# Altium schematic sheet 10 - ETHERNET.SchDoc
size 420 x 297 mm
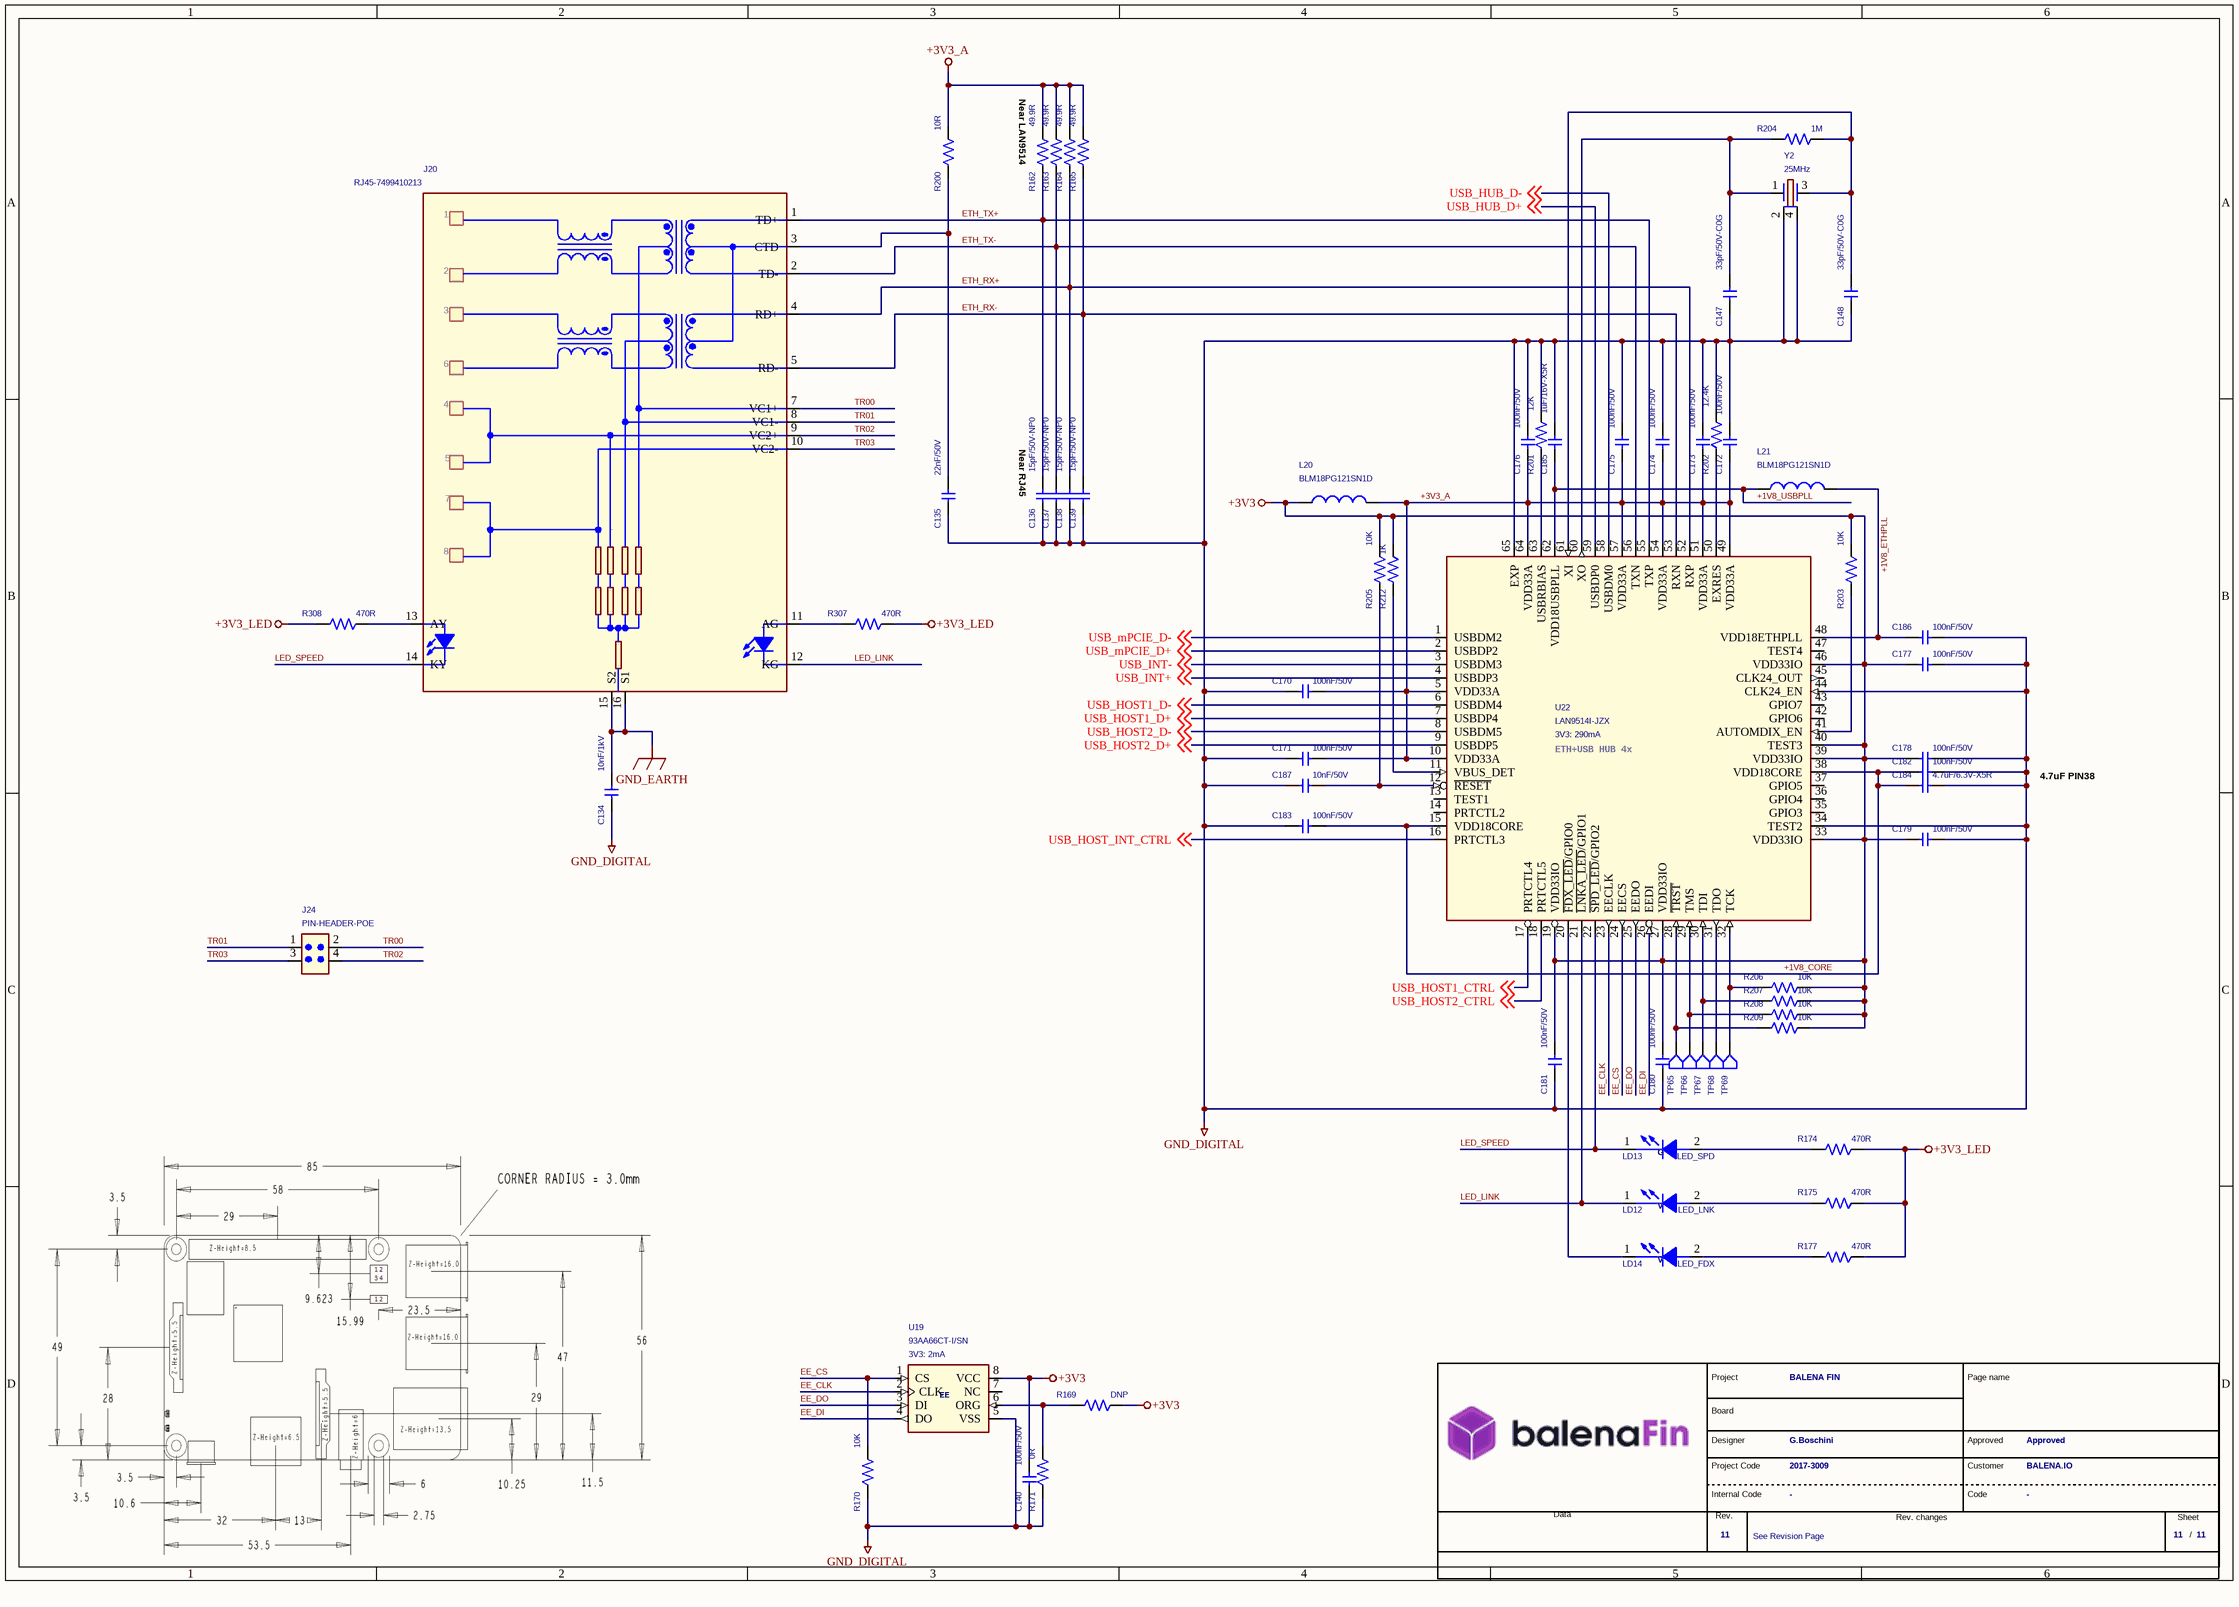
[diagram p0: 10 - ETHERNET.SchDoc]

## Parts
*  Revision: 11  FAE RD code: 2017-3009  DocumentoRev: See Revision Page  Nome Progetto: BALENA FIN  Customer name: BALENA.IO  Project manager: Approved  Project designer: G.Boschini  (hidden comment: MyFAEVuoto)  (graphical)
C134  10nF/1kV  [CS-C-1206]
C135  22nF/50V  [CS-C-0603]
C136  15pF/50V-NP0  [CS-C-0402]
C137  15pF/50V-NP0  [CS-C-0402]
C138  15pF/50V-NP0  [CS-C-0402]
C139  15pF/50V-NP0  [CS-C-0402]
C140  100nF/50V  [CS-C-0402]
C147  33pF/50V-C0G  [CS-C-0402]
C148  33pF/50V-C0G  [CS-C-0402]
C170  100nF/50V  [CS-C-0402]
C171  100nF/50V  [CS-C-0402]
C172  100nF/50V  [CS-C-0402]
C173  100nF/50V  [CS-C-0402]
C174  100nF/50V  [CS-C-0402]
C175  100nF/50V  [CS-C-0402]
C176  100nF/50V  [CS-C-0402]
C177  100nF/50V  [CS-C-0402]
C178  100nF/50V  [CS-C-0402]
C179  100nF/50V  [CS-C-0402]
C180  100nF/50V  [CS-C-0402]
C181  100nF/50V  [CS-C-0402]
C182  100nF/50V  [CS-C-0402]
C183  100nF/50V  [CS-C-0402]
C184  4.7uF/6.3V-X5R  [CS-C-0402]
C185  1uF/16V-X5R  [CS-C-0402]
C186  100nF/50V  [CS-C-0402]
C187  10nF/50V  [CS-C-0402]
J20  RJ45-7499410213  [J-RJ45-7499410213]
J24  PIN-HEADER-POE  [J-2X2-0254-MDT-TSM]
L20  BLM18PG121SN1D  [LS-0603]
L21  BLM18PG121SN1D  [LS-0603]
LD12  LED_LNK  [LD-0603]
LD13  LED_SPD  [LD-0603]
LD14  LED_FDX  [LD-0603]
R162  49.9R  [RS-0402]
R163  49.9R  [RS-0402]
R164  49.9R  [RS-0402]
R165  49.9R  [RS-0402]
R169  DNP  [RS-0402]
R170  10K  [RS-0402]
R171  0R  [RS-0402]
R174  470R  [RS-0402]
R175  470R  [RS-0402]
R177  470R  [RS-0402]
R200  10R  [RS-0402]
R201  12K  [RS-0402]
R202  12.4K  [RS-0402]
R203  10K  [RS-0402]
R204  1M  [RS-0402]
R205  10K  [RS-0402]
R206  10K  [RS-0402]
R207  10K  [RS-0402]
R208  10K  [RS-0402]
R209  10K  [RS-0402]
R212  1K  [RS-0402]
R307  470R  [RS-0402]
R308  470R  [RS-0402]
TP65  TPS  [TPS-0100]  (value not drawn)  (no BOM)
TP66  TPS  [TPS-0100]  (value not drawn)  (no BOM)
TP67  TPS  [TPS-0100]  (value not drawn)  (no BOM)
TP68  TPS  [TPS-0100]  (value not drawn)  (no BOM)
TP69  TPS  [TPS-0100]  (value not drawn)  (no BOM)
U19  93AA66CT-I/SN  Power requirements: 3V3: 2mA  [SOIC8]
U22  LAN9514I-JZX  Power requirements: 3V3: 290mA  [IC-LAN9514]
Y2  25MHz  [Y-ABM8G]

## Nets
+3V3: C140.1 C177.1 C178.1 C179.1 C180.1 C181.1 L20.1 R169.2 R203.2 R205.2 R206.2 R207.2 R208.2 R209.2 R212.2 U19.8(VCC) U22.19(VDD33IO) U22.27(VDD33IO) U22.33(VDD33IO) U22.39(VDD33IO) U22.40(TEST3) U22.46(VDD33IO)
+3V3_A: C170.2 C171.2 C172.2 C173.2 C174.2 C175.2 C176.2 L20.2 R162.2 R163.2 R164.2 R165.2 R200.2 U22.5(VDD33A) U22.10(VDD33A) U22.49(VDD33A) U22.51(VDD33A) U22.54(VDD33A) U22.57(VDD33A) U22.64(VDD33A)
+3V3_LED: R174.2 R175.2 R177.2 R307.2 R308.1
GND_DIGITAL: C134.1 C135.2 C136.2 C137.2 C138.2 C139.2 C140.2 C147.2 C148.2 C170.1 C171.1 C172.1 C173.1 C174.1 C175.1 C176.1 C177.2 C178.2 C179.2 C180.2 C181.2 C182.2 C183.1 C184.2 C185.1 C186.2 C187.1 R170.1 R171.1 R201.2 R202.2 U19.5(VSS) U22.34(TEST2) U22.44(CLK24_EN) U22.65(EXP) Y2.2 Y2.4
GND_EARTH: C134.2 J20.15(S2) J20.16(S1)
+1V8_CORE: C182.1 C183.2 C184.1 U22.15(VDD18CORE) U22.38(VDD18CORE)
+1V8_ETHPLL: C186.1 L21.2 U22.48(VDD18ETHPLL)
+1V8_USBPLL: C185.2 L21.1 U22.62(VDD18USBPLL)
EE_CLK: U19.2(CLK) U22.23(EECLK)
EE_CS: R170.2 U19.1(CS) U22.24(EECS)
EE_DI: U19.4(DO) U22.26(EEDI)
EE_DO: U19.3(DI) U22.25(EEDO)
ETH_RX+: C138.1 J20.4(RD+) R164.1 U22.52(RXP)
ETH_RX-: C139.1 J20.5(RD-) R165.1 U22.53(RXN)
ETH_TX+: C136.1 J20.1(TD+) R162.1 U22.55(TXP)
ETH_TX-: C137.1 J20.2(TD-) R163.1 U22.56(TXN)
LED_LINK: J20.12(KG) LD12.1(C) U22.21(~{LNKA_LED}/GPIO1)
LED_SPEED: J20.14(KY) LD13.1(C) U22.22(~{SPD_LED}/GPIO2)
TR00: J20.7(VC1+) J24.2
TR01: J20.8(VC1-) J24.1
TR02: J20.9(VC2+) J24.4
TR03: J20.10(VC2-) J24.3
USB_HOST1_CTRL: U22.17(PRTCTL4) ; off-sheet USB_HOST1_CTRL
USB_HOST1_D+: U22.7(USBDP4) ; off-sheet USB_HOST1_D+
USB_HOST1_D-: U22.6(USBDM4) ; off-sheet USB_HOST1_D-
USB_HOST2_CTRL: U22.18(PRTCTL5) ; off-sheet USB_HOST2_CTRL
USB_HOST2_D+: U22.9(USBDP5) ; off-sheet USB_HOST2_D+
USB_HOST2_D-: U22.8(USBDM5) ; off-sheet USB_HOST2_D-
USB_HOST_INT_CTRL: U22.16(PRTCTL3) ; off-sheet USB_HOST_INT_CTRL
USB_HUB_D+: U22.59(USBDP0) ; off-sheet USB_HUB_D+
USB_HUB_D-: U22.58(USBDM0) ; off-sheet USB_HUB_D-
USB_INT+: U22.4(USBDP3) ; off-sheet USB_INT+
USB_INT-: U22.3(USBDM3) ; off-sheet USB_INT-
USB_mPCIE_D+: U22.2(USBDP2) ; off-sheet USB_mPCIE_D+
USB_mPCIE_D-: U22.1(USBDM2) ; off-sheet USB_mPCIE_D-
NetC135_1: C135.1 J20.3(CTD) R200.1
NetC147_1: C147.1 R204.1 U22.60(XO) Y2.1
NetC148_1: C148.1 R204.2 U22.61(XI) Y2.3
NetC187_2: C187.2 R205.1 U22.12(~{RESET})
NetJ20_11: J20.11(AG) R307.1
NetJ20_13: J20.13(AY) R308.2
NetLD12_2: LD12.2(A) R175.1
NetLD13_2: LD13.2(A) R174.1
NetLD14_1: LD14.1(C) U22.20(~{FDX_LED}/GPIO0)
NetLD14_2: LD14.2(A) R177.1
NetR169_1: R169.1 R171.2 U19.6(ORG)
NetR201_1: R201.1 U22.63(USBRBIAS)
NetR202_1: R202.1 U22.50(EXRES)
NetR203_1: R203.1 U22.41(AUTOMDIX_EN)
NetR206_1: R206.1 TP69.1(TP) U22.32(TCK)
NetR207_1: R207.1 TP67.1(TP) U22.30(TDI)
NetR208_1: R208.1 TP66.1(TP) U22.29(TMS)
NetR209_1: R209.1 TP65.1(TP) U22.28(~{TRST})
NetR212_1: R212.1 U22.11(VBUS_DET)
NetTP68_1: TP68.1(TP) U22.31(TDO)

Not connected (* = marked no-connect by the designer): U19 7(NC); U22 13(TEST1) 14(PRTCTL2) 35(GPIO3) 36(GPIO4) 37(GPIO5) 42(GPIO6) 43(GPIO7) 45(CLK24_OUT) 47(TEST4)

## Notes on the sheet
- (near R162) Near LAN9514
- (near C136) Near RJ45
- 4.7uF PIN38
- (in symbol EE - 93AA66CT-I-SN - 4Kb) EE
- (in symbol LED G - KPT-1608YC - 0603) G
- (in symbol LED V - GENERICO - 0603) V
- (in symbol MyFAEVuoto) Project; Page name; Board; Designer; Project Code; Customer; Internal Code; Code; Data; Rev.; Rev. changes; Sheet; /
- (in symbol RJ45-POE+ - 7499410213) 6
- (in symbol USB-ETH-HUBx4 - LAN9514I) ETH+USB HUB 4x

## Library data of the parts
C134 = CS-C-1206-10n/1kV: CHIP CAP.CER. 10nF 1000V 10% X7R 1206; MPN: Generic; Alternative MPN: GRM31CR73A103KW03L; Room: ETHERNET+HUB USB; Pkg Type: SMD; Mount: Yes
C135 = CS-C-0603-22n/50V: CHIP CAP.CER. 22nF 50V 10% X7R 0603; MPN: Generic; Room: ETHERNET+HUB USB; Pkg Type: SMD; Mount: Yes
C136-C139 = CS-C-0402-15p/50V-NP0: CHIP CAP.CER. 15pF 50V 5% NPO 0402; MPN: Generic; Pkg Type: SMD; Room: ETHERNET+HUB USB; Mount: Yes
C140 C170-C183 C186 = CS-C-0402-100n/16V: CHIP CAP.CER. 100nF 16V 10% X7R 0402; MPN: Generic; Alternative MPN: C0402C104K4RACTU; Room: ETHERNET+HUB USB; Pkg Type: SMD; Mount: Yes
C147 C148 = CS-C-0402-33p/50V-C0G: CHIP CAP.CER. 33pF 50V 5% C0G 0402; MPN: Generic; Room: ETHERNET+HUB USB; Pkg Type: SMD; Mount: Yes
C184 = CS-C-0402-4.7u/6V3-X5R: CHIP CAP.CER. 4.7uF 6.3V 20% X5R 0402; MPN: Generic; Pkg Type: SMD; Room: ETHERNET+HUB USB; Mount: Yes
C185 = CS-C-0402-1u/16-X5R: CHIP CAP.CER. 1uF 16V 10% X5R 0402; MPN: Generic; Pkg Type: SMD; Room: ETHERNET+HUB USB; Mount: Yes
C187 = CS-C-0402-10n/50V: CHIP CAP.CER. 10nF 50V 10% X7R 0402; MPN: Generic; Alternative MPN: C0402C103K5RACTU; Room: ETHERNET+HUB USB; Pkg Type: SMD; Mount: Yes
J20 = RJ45-POE+ - 7499410213: CONN JACK 1PORT 100 BASE-T PCB PoE+; Alternative MPN: TRJP4162HENL; Pkg Type: THT; Note: Cable clip bottom; Temperature range: -40°..+85°; MPN: 7499410213; Mount: Yes
J24 = STRIP-J-2X2-0254-MDS-TSM: CONN HEADER SMT 4POS 2.54MM DUAL ROW; MPN: Generic; Note: H=9.61mm; Pkg Type: SMD; Temperature range: -55°..+105°; Mount: Yes
L20 L21 = FIL-BLM18PG121SN1D-120R/2A: FERRITE BEAD 120 OHM 0603 1LN; Pkg Type: SMD; Room: ETHERNET+HUB USB; MPN: BLM18PG121SN1D; Mount: Yes
LD12 LD14 = LED V - GENERICO - 0603: LED Green 0603 SMT; Alternative MPN: KP-1608SGC; Pkg Type: SMD; Note: V=2.2V/20mA; Room: ETHERNET+HUB USB; MPN: Generic; Mount: Yes
LD13 = LED G - KPT-1608YC - 0603: LED Yellow 0603 SMT; MPN: Generic; Pkg Type: SMD; Note: V=2.1v/20mA; Room: ETHERNET+HUB USB; Alternative MPN: KPT-1608YC; Mount: Yes
R162-R165 = RS-0402-49.9r: CHIP RES. 49R9 0402 1/16W 1% 100PPM/°C; MPN: Generic; Pkg Type: SMD; Note: 100 ppm; Room: ETHERNET+HUB USB; Temperature range: -55°..+155°; Mount: Yes
R169 = RS-0402: CHIP RES. 0402; MPN: Generic; Pkg Type: SMD; Room: ETHERNET+HUB USB; Mount: No
R170 R203 R205-R209 = RS-0402-10k: CHIP RES. 10K 0402 1/16W 1%; MPN: Generic; Room: ETHERNET+HUB USB; Pkg Type: SMD; Temperature range: -55°..+125°; Mount: Yes
R171 = RS-0402-0r: CHIP RES. 0R 0402 1/16W 1%; MPN: Generic; Room: ETHERNET+HUB USB; Pkg Type: SMD; Mount: Yes
R174 R175 R177 R307 R308 = RS-0402-470r: CHIP RES. 470R 0402 1/16W 1%; MPN: Generic; Pkg Type: SMD; Room: ETHERNET+HUB USB; Mount: Yes
R200 = RS-0402-10r: CHIP RES. 10R 0402 1/16W 1% 100PPM/°C; MPN: Generic; Pkg Type: SMD; Note: 100 ppm; Room: ETHERNET+HUB USB; Temperature range: -55°..+125°; Mount: Yes
R201 = RS-0402-12k: CHIP RES. 12K 0402 1/16W 1%; MPN: Generic; Room: ETHERNET+HUB USB; Pkg Type: SMD; Mount: Yes
R202 = RS-0402-12.4k: CHIP RES. 12K4 0402 1/16W 1% 100PPM/°C; MPN: Generic; Room: ETHERNET+HUB USB; Note: 100ppm; Pkg Type: SMD; Mount: Yes
R204 = RS-0402-1M: CHIP RES. 1M 0402 1/16W 1%; MPN: Generic; Room: ETHERNET+HUB USB; Pkg Type: SMD; Mount: Yes
R212 = RS-0402-1k: CHIP RES. 1K 0402 1/16W 1%; MPN: Generic; Pkg Type: SMD; Room: ETHERNET+HUB USB; Mount: Yes
TP65-TP69 = TEST POINT SMD 1 MM: TEST POINT SMD; MPN: TP-No-BoM; Room: ETHERNET+HUB USB; Pkg Type: SMD; Mount: Yes
U19 = EE - 93AA66CT-I-SN - 4Kb: IC EEPROM 4KBIT SPI 3MHZ 8SOIC; Pkg Type: SMD; Note: VIH=2V - VIL=0.8V - VOL=0.4; Room: ETHERNET+HUB USB; Temperature range: -40°..+85°; MPN: 93AA66CT-I/SN; Mount: Yes
U22 = USB-ETH-HUBx4 - LAN9514I: IC USB 2.0 ETH CTLR IND 64-QFN; Pkg Type: SMD; Note: USB 2.0 + ETH 10/100; Temperature range: -40°..+85°; MPN: LAN9514I-JZX; Mount: Yes
Y2 = QUARZO-ABM8G-25.000MHz: 25MHz ±20ppm Crystal 18pF 60 Ohms 4-SMD, No Lead  D=3.2x2.5; MPN: ABM8G-25.000MHZ- 18-D2Y-T; Pkg Type: SMD; Room: ETHERNET+HUB USB; Mount: Yes
* = MyFAEVuoto: Page Number: 11; Page Count: 11; Customer Code: -; Database: -